# Altium schematic sheet usb.SchDoc
size A4; SheetNumber: 1; SheetTotal: 1
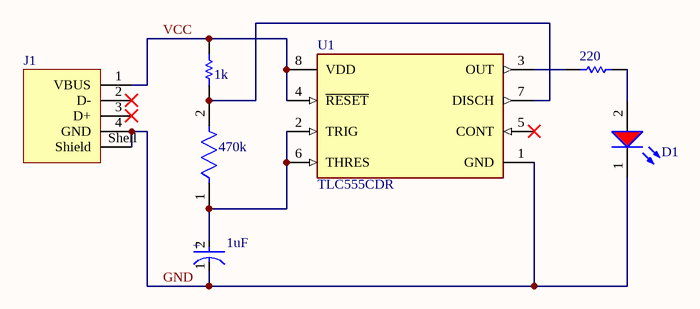
[diagram p0: usb.SchDoc]

## Parts
1k  MCRE000140  [RESC0603X26X15ML03T05]  (value not drawn)
1uF  293D105X0016A2TE3  [FP-293DA-MFG]  (value not drawn)
220  ERJ6ENF2200V  [RESC2013X70X40NL20T20]  (value not drawn)
470k  CRGCQ1206J470K  [FP-CRGCQ1206-IPC_C]  (value not drawn)
D1  150060RS75000  [WL-SMCW_0603_150060xx75000]  (value not drawn)
J1  61400416021  [61400416021]  (value not drawn)
U1  TLC555CDR  [FP-D0008A-IPC_B]

## Nets
GND: 1uF.1(C) D1.1(K) J1.4(GND) J1.Shell(Shield) U1.1(GND)
VCC: 1k.2 J1.1(VBUS) U1.4(~{RESET}) U1.8(VDD)
Net1k_1: 1k.1 470k.2 U1.7(DISCH)
Net1uF_2: 1uF.2(A) 470k.1 U1.2(TRIG) U1.6(THRES)
Net220_1: 220.1 U1.3(OUT)
Net220_2: 220.2 D1.2(A)

Not connected (* = marked no-connect by the designer): J1 2(D-)* 3(D+)*; U1 5(CONT)*

## Notes on the sheet
- (in symbol CMP-00030-40940187-1) +

## Library data of the parts
1k = CMP-2004-02508-1: Manufacturer: Multicomp; Part Number: MCRE000140
1uF = CMP-00030-40940187-1: 293D105X0016A2TE3 Surface Mount Tantalum Capacitor, 1 uF, 16 V, ± 20%, -55 °C, 125 °C, 1206 [3216-18 Metric]; Ripple Current: 90mA; Capacitance: 1µF; Leakage Current: 500nA; Polarity: Polar; Voltage Rating (DC): 16V; Dissipation Factor: 4%; ESR (Equivalent Series Resistance): 9.3Ω; Case Code (Imperial): 1206; Case/Package: 1206; Schedule B: 8532210050, 8532210050; Height: 1.8mm; Mount: PCB, Surface Mount; Height - Seated (Max): 1.8034mm; Min Operating Temperature: -55°C; Max Operating Temperature: 125°C; Dielectric Material: Tantalum; Packaging: Tape and Reel; Radiation Hardening: No; Lead Free: Lead Free; Features: General Purpose; REACH SVHC: Unknown; Width: 1.6002mm; RoHS: Compliant; Tolerance: 20%; Termination: SMD/SMT; Length: 3.2mm; Depth: 1.6mm; Number of Pins: 2; Voltage Rating: 16V; NexarPartId: 40940187; Case Code (Metric): 3216
220 = CMP-2001-00044-1: Manufacturer: Panasonic; Part Number: ERJ6ENF2200V
470k = CMP-03211-000281-1: CRGCQ1206 470KΩ 0.25W 5% ±100ppm/°C 200V; Manufacturer: TE Connectivity; Tolerance: 0.05; Device Class L1: Passive Components; Temperature Coefficient: ±100ppm/°C; Automotive Grade: Grade 1294; Automotive: Yes; Lead Free: Yes; Value: 470KΩ; Temperature Range Low: -55°C; Voltage Rating: 200V; Temperature Range High: +155°C; Category: Res; Device Class L3: Chip SMD Resistors; Device Class L2: Resistors; Manufacturer Part Number: CRGCQ1206J470K; Ambient Temperature Range High: +70°C; Package: CRGCQ1206; Height: 0.65mm; Power Rating: 0.25W; ComponentLink2URL: https://www.te.com/commerce/DocumentDelivery/DDEController?Action=showdoc&DocId=Data+Sheet%7F1773204-3%7F1%7Fpdf%7FEnglish%7FENG_DS_1773204-3_1.pdf%7F4-2176347-1303; Composition: Thick Film; Resistance: 470KΩ; ComponentLink2Description: Datasheet; Series: CRGCQ; Temperature: -55°C to +155°C; RoHS: TRUE; Ipc Land Pattern Name: RESC310155X55; Octopart: https://octopart.com/crgcq1206j470k-te+connectivity-91018332
D1 = CMP-1426-00001-3: NexarPartId: 29717776; Color: Red; Power Dissipation: 72mW; Max Reverse Voltage (DC): 5V; Peak Wavelength: 630nm; Viewing Angle: 140°; Forward Voltage: 2V; Luminous Intensity: 250mcd; Forward Current: 100mA; Dominant Wavelength: 625nm; Lens Style: Clear, Rectangular; Max Junction Temperature (Tj): 95°C; Test Current: 20mA; Mount: Surface Mount; Packaging: Tape and Reel; Case Code (Metric): 1608; Max Operating Temperature: 85°C; Case Code (Imperial): 0603; REACH SVHC: Unknown; Width: 800µm; Length: 1.6mm; Reverse Voltage: 5V; Height: 700µm; Case/Package: 0603; RoHS: Compliant; Wavelength: 625nm; Min Operating Temperature: -40°C
J1 = CMP-1502-03227-2: NexarPartId: 21041530; Contact Resistance: 20mΩ; Gender: Receptacle; Voltage Rating (DC): 30V; Current Rating: 1.5A; Connector Type: USB; Insulation Resistance: 1GΩ; USB Standard: USB 2.0; Number of Contacts: 4; Number of Ports: 1; Width: 14.4mm; REACH SVHC: Unknown; Contact Plating: Gold; Length: 15.8mm; Lead Free: Lead Free; Max Operating Temperature: 105°C; Orientation: Horizontal; Contact Material: Copper; Voltage Rating: 30V; Min Operating Temperature: -40°C; Flammability Rating: UL94 V-0; Color: White; RoHS: Compliant; Number of Pins: 4; Mount: Horizontal, Through Hole; Number of Positions: 4; Operating Supply Voltage: 30V; Insulation Material: PBT; Termination: Solder
U1 = CMP-04857-000001-1: IC OSC SGL TIMER 2.1MHZ 8-SOIC; Min Supply Voltage: 2V; Number of Channels: 1; Max Power Dissipation: 725mW; Max Supply Voltage: 15V; Low Level Output Current: 100mA; Current Rating: 250A; Quiescent Current: 250uA; Operating Supply Current: 360uA; High Level Output Current: -10mA; Width: 3.91mm; Case/Package: SOIC; Weight: 0.002561oz; Frequency: 2.1MHz; Height: 1.58mm; Package Quantity: 2500; REACH SVHC: No SVHC; Number of Timers/Counters: 1; Lead Free: Lead Free; Number of Pins: 8; Max Operating Temperature: 125°C; Min Operating Temperature: -40°C; Length: 4.9mm; Radiation Hardening: No; Packaging: Tape and Reel; Termination: SMD/SMT; Mount: Surface Mount; Power Dissipation: 725mW